# Altium schematic sheet Battery manager.SchDoc
size A4
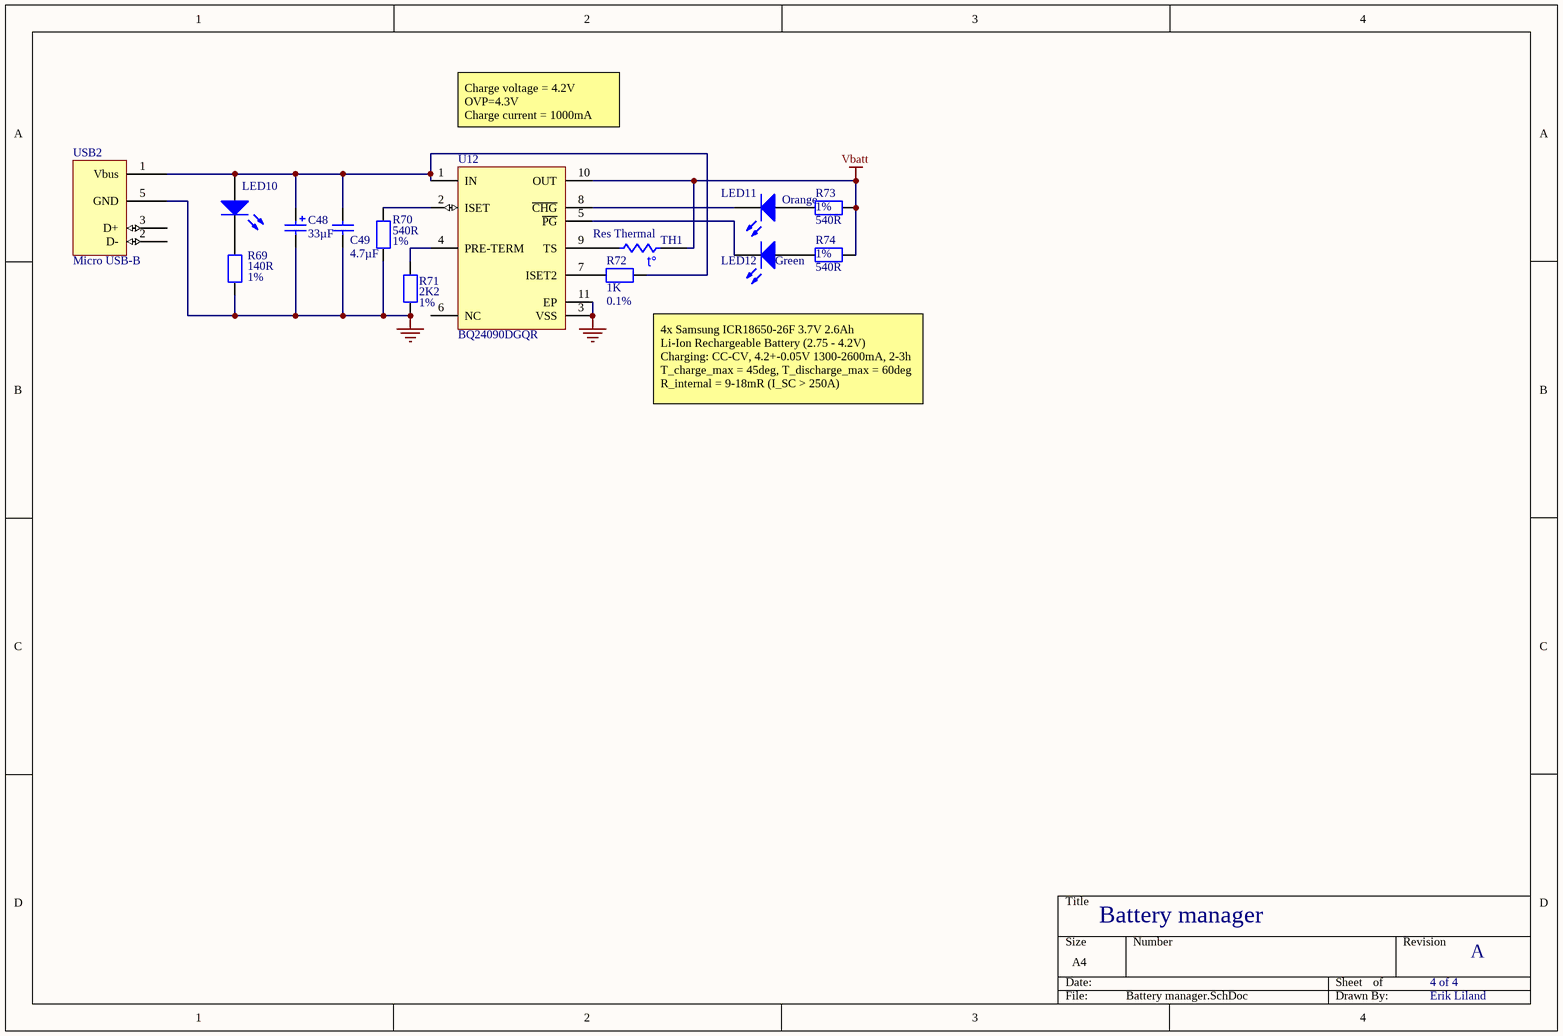
[diagram p0: Battery manager.SchDoc]

## Parts
C48  33µF  [CAP SMD (F)]
C49  4.7µF  [0805_N_CAP]
LED10  LED  [0805_N_LED]  (value not drawn)
LED11  Orange  [LED ANGLE SMD YELLOW]
LED12  Green  [LED ANGLE SMD GREEN]
R69  140R  Tolerance: 1%  [0805_N_RES]
R70  540R  Tolerance: 1%  [0805_N_RES]
R71  2K2  Tolerance: 1%  [0805_N_RES]
R72  1K  Tolerance: 0.1%  [0805_N_RES]
R73  540R  Tolerance: 1%  [0805_N_RES]
R74  540R  Tolerance: 1%  [0805_N_RES]
TH1  Res Thermal  [HDR1X2]
U12  BQ24090DGQR  [DGQ10-1675X1445TP_M]
USB2  Micro USB-B  [USB_TYPEB_SMD]

## Nets
GND: C48.2 C49.2 R69.1 R70.1 R71.1 U12.3(VSS) U12.11(EP) USB2.5(GND)
Vbatt: R73.1 R74.1 TH1.1 U12.10(OUT)
NetC48_1: C48.1 C49.1 LED10.1(A) R72.1 U12.1(IN) USB2.1(Vbus)
NetLED10_2: LED10.2(K) R69.2
NetLED11_1: LED11.1(A) R73.2
NetLED11_2: LED11.2(K) U12.8(~{CHG})
NetLED12_1: LED12.1(A) R74.2
NetLED12_2: LED12.2(K) U12.5(~{PG})
NetR70_2: R70.2 U12.2(ISET)
NetR71_2: R71.2 U12.4(PRE-TERM)
NetR72_2: R72.2 U12.7(ISET2)
NetTH1_2: TH1.2 U12.9(TS)

Not connected (* = marked no-connect by the designer): U12 6(NC); USB2 2(D-) 3(D+)

## Notes on the sheet
- Charge voltage = 4.2V
  OVP=4.3V
  Charge current = 1000mA
- 4x Samsung ICR18650-26F 3.7V 2.6Ah
  Li-Ion Rechargeable Battery (2.75 - 4.2V)
  Charging: CC-CV, 4.2+-0.05V 1300-2600mA, 2-3h
  T_charge_max = 45deg, T_discharge_max = 60deg
  R_internal = 9-18mR (I_SC > 250A)
- Battery manager
- 4 of 4
- A
- Erik Liland
- (in symbol Res Thermal) t°

## Library data of the parts
C48 = Cap Pol: Polarized Capacitor; Manufacturer: Panasonic Electronic Components; Manufacturer Part Number: EEH-ZA1E330R; Tolerance: ±20%; ESR (Equivalent Series Resistance): 80 mOhm; Lifetime @ Temp.: 10000 Hrs @ 105°C; Type: Polymer - Hybrid; Ripple Current: 900mA; Surface Mount Land Size: 0.209" L x 0.209" W (5.30mm x 5.30mm); Voltage - Rated: 25V; Supplier 1: Digi-Key; Supplier Part Number 1: P15438CT-ND; RoHS: RoHS Compliant; Category: Capacitors; Stock 1: 7514; Pricing 1: 1=1.58, 10=1.291, 25=1.1648, 50=1.1332, 100=1.0389, 250=0.91296, 500=0.85 (EUR); Packaging: Cut Tape (CT); Capacitance: 33µF; Operating Temperature: -55°C ~ 105°C; Size / Dimension: 0.197" Dia (5.00mm); Height - Seated (Max): 0.240" (6.10mm); Mounting Type: Surface Mount; Package / Case: Radial, Can - SMD; ComponentLink1URL: http://industrial.panasonic.com/www-data/pdf/ABA0000/ABA0000CE136.pdf; ComponentLink1Description: http://industrial.panasonic.com/www-data/pdf/ABA0000/ABA0000CE136.pdf
C49 = Cap: Capacitor; Manufacturer: Samsung Electro-Mechanics America, Inc; Manufacturer Part Number: CL21B475KOFNFNE; Tolerance: ±10%; Voltage - Rated: 16V; Temperature Coefficient: X7R; Supplier 1: Digi-Key; Supplier Part Number 1: 1276-2970-1-ND; RoHS: RoHS Compliant; Category: Capacitors; Stock 1: 58798; Pricing 1: 1=0.27, 10=0.18, 25=0.1308, 100=0.0915, 500=0.06538, 1000=0.05557 (EUR); Packaging: Cut Tape (CT); Capacitance: 4.7µF; Mounting Type: Surface Mount, MLCC; Operating Temperature: -55°C ~ 125°C; Package / Case: 0805 (2012 Metric); Size / Dimension: 0.079" L x 0.049" W (2.00mm x 1.25mm); Height - Seated (Max): -; Thickness (Max): 0.053" (1.35mm); ComponentLink1URL: http://www.samsungsem.com/kr/front/downloadcms.do?path=/kr/support/product-search/mlcc/__icsFiles/afieldfile/2014/11/05&fileName=S_CL21B475KOFNFNE.pdf; ComponentLink1Description: http://www.samsungsem.com/kr/front/downloadcms.do?path=/kr/support/product-search/mlcc/__icsFiles/afieldfile/2014/11/05&fileName=S_CL21B475KOFNFNE.pdf
LED10 = LED: Typical RED, GREEN, YELLOW, AMBER; Manufacturer: OSRAM Opto Semiconductors Inc; Manufacturer Part Number: LG R971-KN-1; Wavelength - Dominant: 570nm; Wavelength - Peak: 572nm; Millicandela Rating: 26.05mcd; Voltage - Forward (Vf) (Typ): 2.2V; Current - Test: 20mA; Viewing Angle: 160°; Lens Style/Size: Rectangle with Flat Top, 1.30mm x 1.25mm; Lens Transparency: Diffused; Lens Color: White; Supplier 1: Digi-Key; Supplier Part Number 1: 475-1410-1-ND; RoHS: RoHS Compliant; Category: Optoelectronics; Stock 1: 152991; Pricing 1: 1=0.1, 10=0.087, 100=0.0691, 250=0.06048, 500=0.05526 (EUR); Packaging: Cut Tape (CT); Color: Green; Package / Case: 0805 (2012 Metric); Size / Dimension: 2.00mm L x 1.25mm W; Mounting Type: Surface Mount; ComponentLink1URL: http://www.osram-os.com/Graphics/XPic9/00078860_0.pdf; ComponentLink1Description: http://www.osram-os.com/Graphics/XPic9/00078860_0.pdf; Supplier Device Package: *; Height (Max): 0.90mm
LED11 LED12 = LED HOR: Horisontal LED; Manufacturer: Kingbright; Manufacturer Part Number: APA3010SECK-GX; Wavelength - Dominant: 601nm; Wavelength - Peak: 610nm; Millicandela Rating: 250mcd; Voltage - Forward (Vf) (Typ): 2.1V; Current - Test: 20mA; Viewing Angle: 120°; Lens Style/Size: Rectangle with Domed Top, 2.00mm x 1.00mm; Lens Transparency: Clear; Lens Color: Colorless; Supplier 1: Digi-Key; Supplier Part Number 1: 754-1842-1-ND; RoHS: RoHS Compliant; Category: Optoelectronics; Stock 1: 1960; Pricing 1: 1=0.31, 10=0.236, 25=0.1888, 100=0.1704, 250=0.15732, 500=0.1416 (EUR); Packaging: Cut Tape (CT); Package / Case: 2-SMD, No Lead; Size / Dimension: 3.00mm L x 2.00mm W; Mounting Type: Surface Mount, Right Angle; ComponentLink1URL: http://www.kingbrightusa.com/images/catalog/SPEC/APA3010SECK-GX.pdf; ComponentLink1Description: http://www.kingbrightusa.com/images/catalog/SPEC/APA3010SECK-GX.pdf; Supplier Device Package: 2-SMD; Height (Max): 1.00mm
  LED11: Color: Orange
  LED12: Color: Green
R69 = Res: Resistor; Manufacturer: Samsung Electro-Mechanics America, Inc; Manufacturer Part Number: RC2012F1400CS; Power (Watts): 0.125W, 1/8W; Resistance (Ohms): 140; Temperature Coefficient: ±100ppm/°C; Value: 140R; Category: Resistors; ComponentLink1Description: http://www.samsungsem.com/global/support/library/product-catalog/__icsFiles/afieldfile/2015/01/12/CHIP_RESISTOR_150112_1.pdf; ComponentLink1URL: http://www.samsungsem.com/global/support/library/product-catalog/__icsFiles/afieldfile/2015/01/12/CHIP_RESISTOR_150112_1.pdf; Composition: Thick Film; Height: 0.024" (0.60mm); Number of Terminations: 2; Operating Temperature: -55°C ~ 155°C; Package / Case: 0805 (2012 Metric); Packaging: Cut Tape (CT); Pricing 1: 1=0.1, 10=0.022, 25=0.016, 100=0.0092, 500=0.00558, 1000=0.00411, 2500=0.00358 (EUR); RoHS: RoHS Compliant; Size / Dimension: 0.079" L x 0.049" W (2.00mm x 1.25mm); Stock 1: 7060; Supplier 1: Digi-Key; Supplier Device Package: 0805 (2012 Metric); Supplier Part Number 1: 1276-5229-1-ND
R70 R73 R74 = Res: Resistor; Value: 540R; Category: Resistors
R71 = Res: Resistor; Manufacturer: Samsung Electro-Mechanics America, Inc; Manufacturer Part Number: RC2012F222CS; Power (Watts): 0.125W, 1/8W; Resistance (Ohms): 2.2k; Temperature Coefficient: ±100ppm/°C; Value: 2K2; Category: Resistors; ComponentLink1Description: http://www.samsungsem.com/global/support/library/product-catalog/__icsFiles/afieldfile/2015/01/12/CHIP_RESISTOR_150112_1.pdf; ComponentLink1URL: http://www.samsungsem.com/global/support/library/product-catalog/__icsFiles/afieldfile/2015/01/12/CHIP_RESISTOR_150112_1.pdf; Composition: Thick Film; Height: 0.024" (0.60mm); Number of Terminations: 2; Operating Temperature: -55°C ~ 155°C; Package / Case: 0805 (2012 Metric); Packaging: Cut Tape (CT); Pricing 1: 1=0.1, 10=0.022, 25=0.016, 100=0.0092, 500=0.00558, 1000=0.00411, 2500=0.00358 (EUR); RoHS: RoHS Compliant; Size / Dimension: 0.079" L x 0.049" W (2.00mm x 1.25mm); Stock 1: 21595; Supplier 1: Digi-Key; Supplier Device Package: 0805 (2012 Metric); Supplier Part Number 1: 1276-5290-1-ND
R72 = Res: Resistor; Manufacturer: Panasonic Electronic Components; Manufacturer Part Number: ERA-6AEB102V; Power (Watts): 0.125W, 1/8W; Temperature Coefficient: ±25ppm/°C; Value: 1K; Category: Resistors; ComponentLink1Description: http://industrial.panasonic.com/www-cgi/jvcr13pz.cgi?E+PZ+3+AOA0026+ERA6AEB102V+7+WW; ComponentLink1URL: http://industrial.panasonic.com/www-cgi/jvcr13pz.cgi?E+PZ+3+AOA0026+ERA6AEB102V+7+WW; Composition: Thin Film; Height: 0.024" (0.60mm); Number of Terminations: 2; Operating Temperature: -55°C ~ 155°C; Package / Case: 0805 (2012 Metric); Packaging: Cut Tape (CT); Pricing 1: 1=0.64, 50=0.2516, 100=0.194, 250=0.15092, 500=0.10636, 1000=0.07761 (EUR); Resistance (Ohms): 1k; RoHS: RoHS Compliant; Size / Dimension: 0.079" L x 0.049" W (2.00mm x 1.25mm); Stock 1: 142110; Supplier 1: Digi-Key; Supplier Device Package: 0805; Supplier Part Number 1: P1.0KDACT-ND
TH1 = Res Thermal: Thermistor; Manufacturer: Harwin Inc; Manufacturer Part Number: M20-9990246; Connector Type: Header, Unshrouded, Breakaway; Number of Positions: 2; Number of Positions Loaded: All; Pitch: 0.100" (2.54mm); Supplier 1: Digi-Key; Supplier Part Number 1: 952-2262-ND; RoHS: RoHS Compliant; Category: Connectors, Interconnects; Stock 1: 46180; Pricing 1: 1=0.11, 10=0.1, 25=0.0744, 50=0.0636, 100=0.0614, 250=0.05296, 500=0.05082, 1000=0.04448, 2500=0.04024 (EUR); Packaging: Bulk; Contact Type: Male Pin; Number of Rows: 1; Row Spacing: -; Contact Mating Length: 0.240" (6.10mm); Mounting Type: Through Hole; Termination: Solder; Fastening Type: -; Features: -; Contact Finish: Tin; Contact Finish Thickness: -; Color: Black; ComponentLink1URL: http://cdn.harwin.com/pdfs/M20-999.pdf; ComponentLink1Description: http://cdn.harwin.com/pdfs/M20-999.pdf; Supplier 2: Digi-Key; Supplier Part Number 2: BC2464-ND; Published: 24-Mar-1999; LatestRevisionDate: 29-May-2009; LatestRevisionNote: IPC-7351 Footprint Added.; PackageVersion: Mar-2003; PackageReference: 6-0805; Publisher: Altium Limited; PackageDescription: Chip Resistor 0805 Case Size; Code_IPC: RESC2012
U12 = CMP-0321-00917-1: 1 A, Single Input, Single Cell Li-Ion Battery Charger with 10 K ohm NTC, 4.5 V, -40 to 150 degC, 10-pin MSOP-PowerPAD (DGQ), Green (RoHS & no Sb/Br); Manufacturer: Texas Instruments; Li-Ion: N; SubFamily: Battery Charge Management; Vin(Min)(V): 4.5; PartNumber: BQ24090DGQR; Mounting Technology: Surface Mount; Eco-Plan: Green (RoHS & no Sb/Br); DatasheetVersion: SLUS968C; PackageDescription: 10-Pin PowerPAD Plastic Small Outline 0.5 mm Pitch, Exposed Pad; NiMH: N; ComponentLink1URL: http://www.ti.com/general/docs/lit/getliterature.tsp?genericPartNumber=BQ24090&fileType=pdf; Over Voltage Protection: N; Code_JEDEC: MO-187-BA-T; NiCd: N; PackageReference: DGQ10-1675X1445TP; Lead Acid: N; PackageVersion: revF, Nov-2011; Li-Polymer: N; ComponentLink1Description: Datasheet; Supplier 1: Digi-Key; Supplier Part Number 1: 296-38875-1-ND
USB2 = USB_micro_B: Horisontal micro usb b; Manufacturer: FCI; Manufacturer Part Number: 10118194-0001LF; Connector Type: USB - micro B; Number of Contacts: 5; Gender: Receptacle; Specifications: USB 2.0; Supplier 1: Digi-Key; Supplier Part Number 1: 609-4618-1-ND; RoHS: RoHS Compliant; Category: Connectors, Interconnects; Stock 1: 4951; Pricing 1: 1=0.46, 10=0.437, 25=0.3744, 100=0.3058, 250=0.27456, 500=0.2621 (EUR); Packaging: Cut Tape (CT); Mounting Type: Surface Mount, Right Angle, Horizontal; Features: Shielded, Solder Retention; Ingress Protection: -; ComponentLink1URL: http://portal.fciconnect.com/Comergent//fci/drawing/10118194.pdf; ComponentLink1Description: http://portal.fciconnect.com/Comergent//fci/drawing/10118194.pdf